# EAGLE design Pioneer_Kit_Shield (EAGLE 7.7.0)

## Sheet 1 of 2
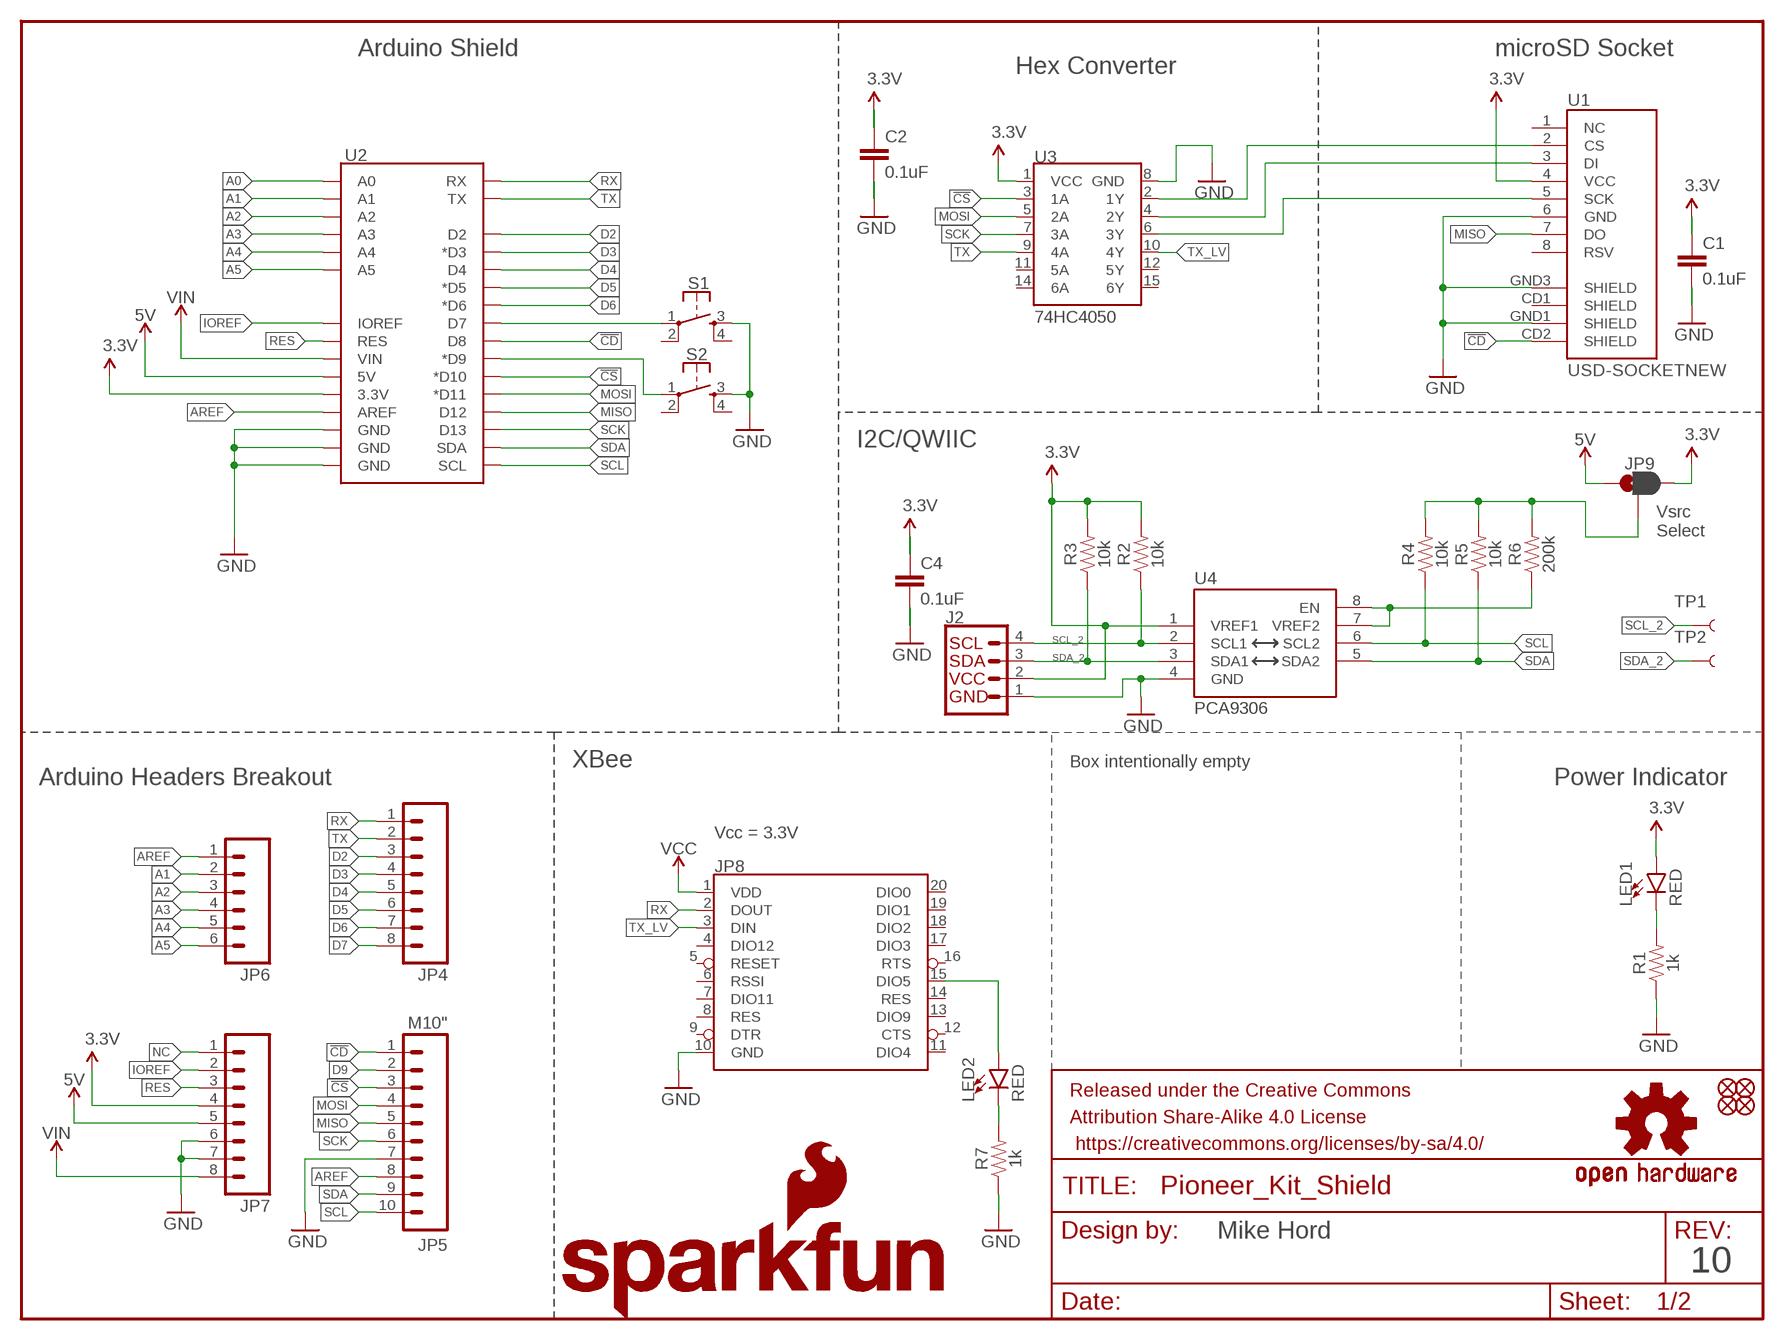
[diagram p0: schematic, sheet 1]

### Parts
C1  0.1uF  0.1UF-0603-25V-5%  [0603]
C2  0.1uF  0.1UF-0603-25V-5%  [0603]
C4  0.1uF  0.1UF-0603-25V-5%  [0603]
FRAME1  FRAME-LETTER  [CREATIVE_COMMONS]
J2  QWIIC_CONNECTORJS-1MM  [1X04_1MM_RA]
JP1  SFE_LOGO_NAME_FLAME.1_INCH  [SFE_LOGO_NAME_FLAME_.1]
JP2  FIDUCIAL1X2  [FIDUCIAL-1X2]
JP3  FIDUCIAL1X2  [FIDUCIAL-1X2]
JP4  M08  [1X08]
JP5  M10"  [1X10]
JP6  M06SIP  [1X06]
JP7  M081X08  [1X08]
JP8  XBEESMD  [XBEE-SMD]
JP9  JUMPER-SMT_3_1-NC_PASTE_SILK  [SMT-JUMPER_3_1-NC_PASTE_SILK]
JP10  FIDUCIAL1X2  [FIDUCIAL-1X2]
JP11  FIDUCIAL1X2  [FIDUCIAL-1X2]
LED1  RED  LED-RED0603  [LED-0603]
LED2  RED  LED-RED0603  [LED-0603]
LOGO1  OSHW-LOGOM  [OSHW-LOGO-M]
R1  1k  1KOHM-0603-1/10W-1%  [0603]
R2  10k  10KOHM-0603-1/10W-1%  [0603]
R3  10k  10KOHM-0603-1/10W-1%  [0603]
R4  10k  10KOHM-0603-1/10W-1%  [0603]
R5  10k  10KOHM-0603-1/10W-1%  [0603]
R6  200k  200KOHM-0603-1/10W-1%  [0603]
R7  1k  1KOHM-0603-1/10W-1%  [0603]
S1  MOMENTARY-SWITCH-SPST-2-SMD-5.2MM  [TACTILE_SWITCH_SMD_5.2MM]
S2  MOMENTARY-SWITCH-SPST-2-SMD-5.2MM  [TACTILE_SWITCH_SMD_5.2MM]
TP1  TEST-POINTTP_15TH_THRU  [TP_15TH]
TP2  TEST-POINTTP_15TH_THRU  [TP_15TH]
U1  USD-SOCKETNEW  [MICRO-SD-SOCKET-PP]
U2  ARDUINO_UNO_R3_SHIELDUNO_R3_SHIELD_NOLABELS_LOCK  [UNO_R3_SHIELD_NOLABELS_LOCK]
U3  74HC4050  HEX_CONVERTER  [SO16]
U4  PCA9306  PCA9306PCA9306DC-1:1  [PCA9306DC]

### Nets
3.3V: C1.1 C2.1 C4.1 J2.2(VCC) JP7.4 JP9.3 LED1.A R2.2 R3.2 U1.4(VCC) U2.3.3V U3.1(VCC) U4.1(VREF1)
5V: JP7.5 JP9.1 U2.5V ; also sheet 2
!CD: JP5.1 U1.CD2(SHIELD) U2.D8
!CS: JP5.3 U2.D10(*D10) U3.3(1A)
A0: JP6.1 U2.A0
A1: JP6.2 U2.A1
A2: JP6.3 U2.A2
A3: JP6.4 U2.A3
A4: JP6.5 U2.A4
A5: JP6.6 U2.A5
AREF: JP5.8 U2.AREF
D2: JP4.3 U2.D2
D3: JP4.4 U2.D3(*D3)
D4: JP4.5 U2.D4
D5: JP4.6 U2.D5(*D5)
D6: JP4.7 U2.D6(*D6)
D7: JP4.8 S1.1 U2.D7
D9: JP5.2 S2.1 U2.D9(*D9)
GND: C1.2 C2.2 C4.2 J2.1(GND) JP5.7 JP7.6 JP7.7 JP8.10(GND) R1.1 R7.1 S1.3 S2.3 U1.6(GND) U1.GND1(SHIELD) U1.GND3(SHIELD) U2.GND@0(GND) U2.GND@1(GND) U2.GND@2(GND) U3.8(GND) U4.4(GND) ; also sheet 2
IOREF: JP7.2 U2.IOREF
MISO: JP5.5 U1.7(DO) U2.D12
MOSI: JP5.4 U2.D11(*D11) U3.5(2A)
N$1: LED2.C R7.2
N$2: U1.3(DI) U3.4(2Y)
N$3: JP8.15(DIO5) LED2.A
N$4: U1.5(SCK) U3.6(3Y)
N$6: LED1.C R1.2
N$9: JP9.2 R4.2 R5.2 R6.2
N$19: R6.1 U4.7(VREF2) U4.8(EN)
N$163: U1.2(CS) U3.2(1Y)
NC: JP7.1
RES: JP7.3 U2.RES
RX: JP4.1 JP8.2(DOUT) U2.RX
SCK: JP5.6 U2.D13 U3.7(3A)
SCL: JP5.10 R4.1 U2.SCL U4.6(SCL2)
SCL_2: J2.4(SCL) R2.1 TP1.P$1 U4.2(SCL1)
SDA: JP5.9 R5.1 U2.SDA U4.5(SDA2)
SDA_2: J2.3(SDA) R3.1 TP2.P$1 U4.3(SDA1)
TX: JP4.2 U2.TX U3.9(4A)
TX_LV: JP8.3(DIN) U3.10(4Y)
VCC: JP8.1(VDD) ; also sheet 2
VIN: JP7.8 U2.VIN
Unconnected: JP8.4(DIO12) JP8.5(RESET) JP8.6(RSSI) JP8.7(DIO11) JP8.8(RES) JP8.9(DTR) JP8.11(DIO4) JP8.12(CTS) JP8.13(DIO9) JP8.14(RES) JP8.16(RTS) JP8.17(DIO3) JP8.18(DIO2) JP8.19(DIO1) JP8.20(DIO0) S1.2 S1.4 S2.2 S2.4 U1.1(NC) U1.8(RSV) U1.CD1(SHIELD) U3.11(5A) U3.12(5Y) U3.14(6A) U3.15(6Y)

### Notes on the sheet
- Arduino Shield | microSD Socket
- Hex Converter
- I2C/QWIIC
- Vsrc
  Select
- XBee | Box intentionally empty | Power Indicator
- Arduino Headers Breakout
- Vcc = 3.3V
- Mike Hord
- 10

## Sheet 2 of 2
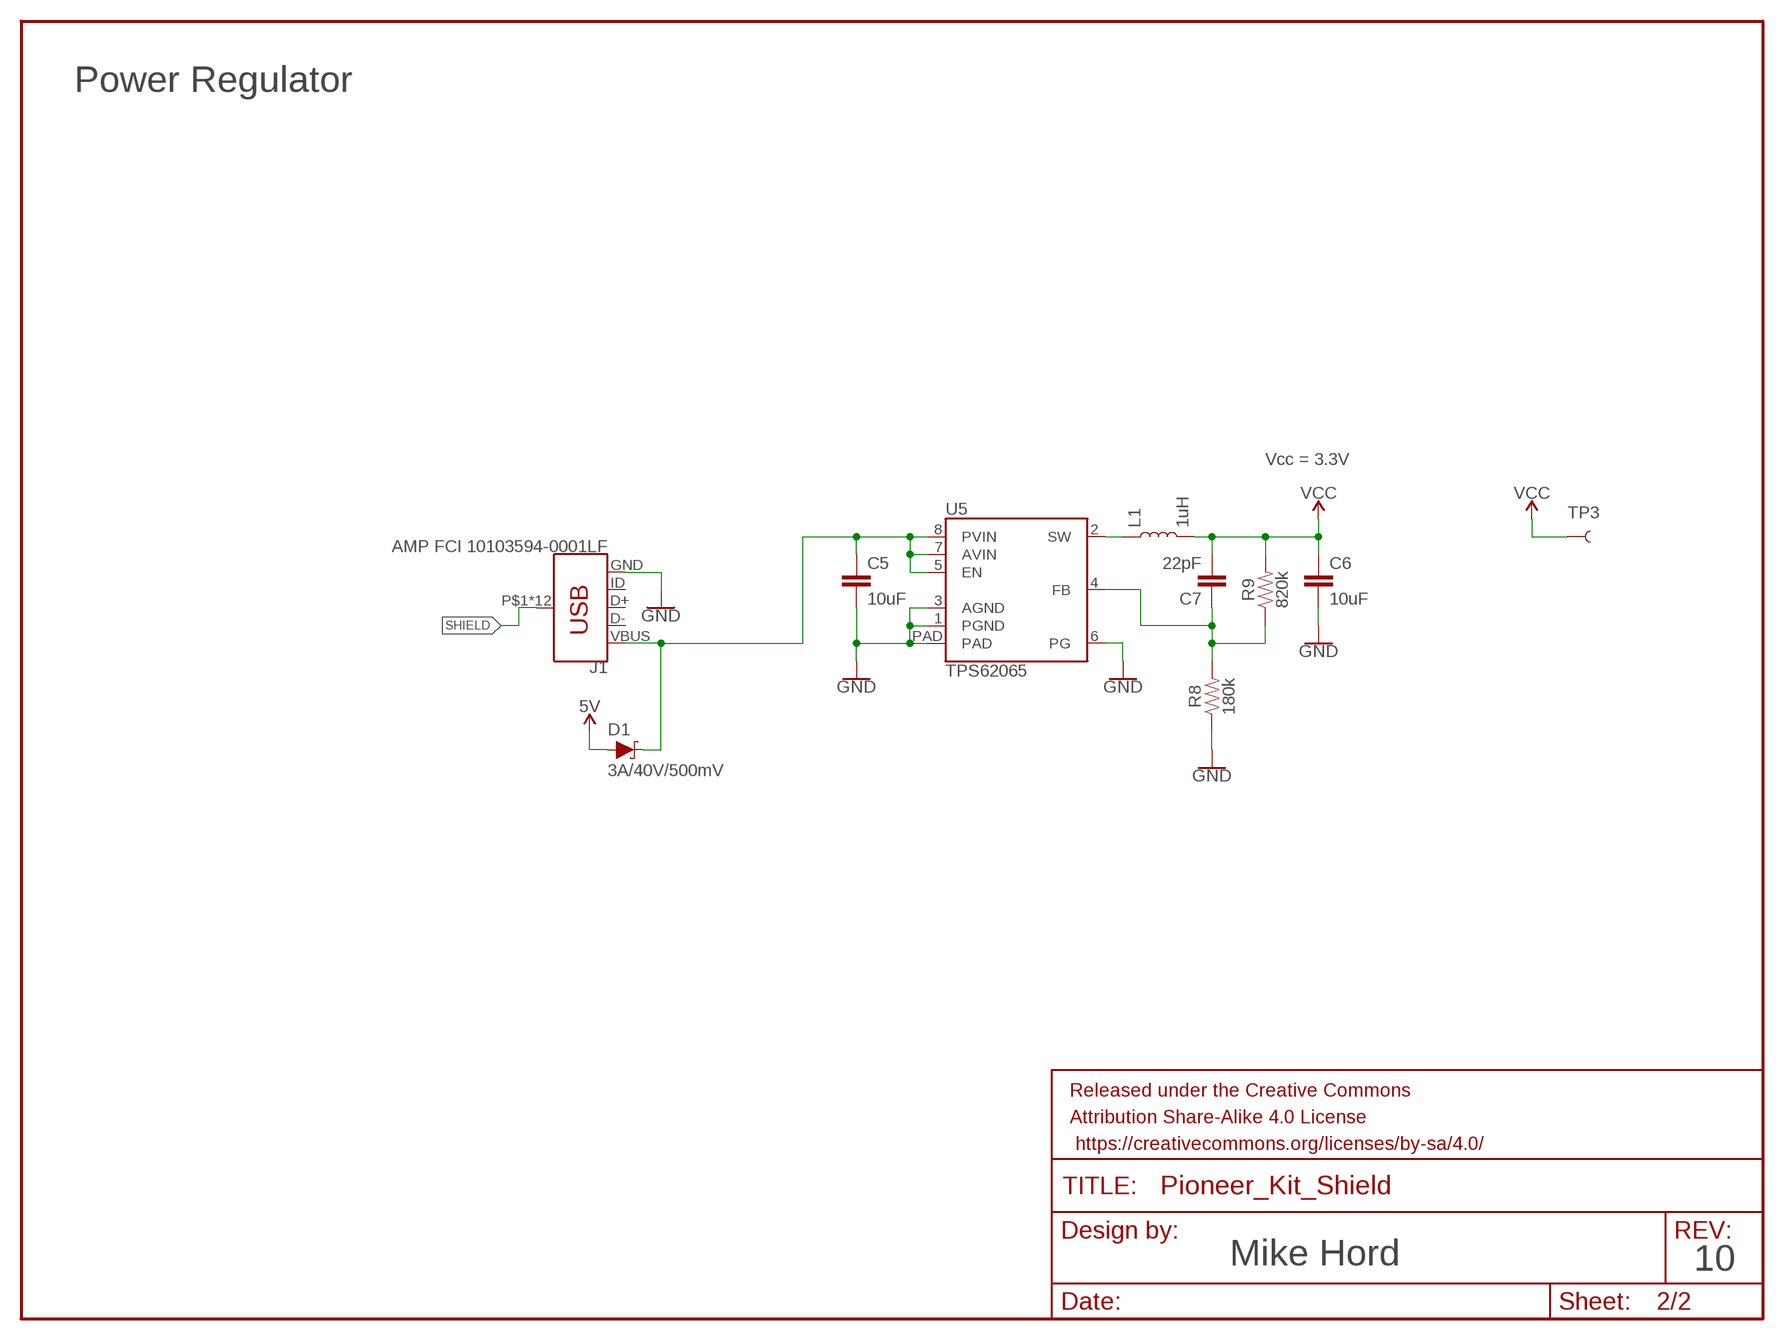
[diagram p1: schematic, sheet 2]

### Parts
C5  10uF  10UF-0805-10V-10%  [0805]
C6  10uF  10UF-0603-6.3V-20%  [0603]
C7  22pF  22PF-0603-50V-5%  [0603]
D1  3A/40V/500mV  DIODE-SCHOTTKY-B340A  [SMA-DIODE]
FRAME2  FRAME-LETTERNO_PACKAGE  [DUMMY]
J1  AMP FCI 10103594-0001LF  USB_MICRO-B_HALF_PTH  [USB-MICROB-PTH]
L1  1uH  INDUCTOR-SRP4020-1UH  [INDUCTOR-SRP4020]
R8  180k  180KOHM-0603-1/10W-1%  [0603]
R9  820k  820KOHM-0603-1/10W-1%  [0603]
TP3  TEST-POINTTP_15TH_THRU  [TP_15TH]
U5  TPS62065  [WSON-8-PAD]

### Nets
5V: D1.A ; also sheet 1
GND: C5.2 C6.2 J1.GND R8.1 U5.1(PGND) U5.3(AGND) U5.6(PG) U5.PAD ; also sheet 1
N$20: C5.1 D1.C J1.VBUS U5.5(EN) U5.7(AVIN) U5.8(PVIN)
N$31: C7.1 R8.2 R9.1 U5.4(FB)
N$32: L1.P$1 U5.2(SW)
SHIELD: J1.P$1(SHIELD) J1.P$2(SHIELD) J1.P$3(SHIELD) J1.P$4(SHIELD) J1.P$6(SHIELD) J1.P$8(SHIELD) J1.P$10(SHIELD) J1.P$12(SHIELD) J1.SHEILD2(SHIELD) J1.SHIELD J1.SHIELD3(SHIELD) J1.SHIELD4(SHIELD)
VCC: C6.1 C7.2 L1.P$2 R9.2 TP3.P$1 ; also sheet 1
Unconnected: J1.D+ J1.D- J1.ID

### Notes on the sheet
- Power Regulator
- Vcc = 3.3V
- Mike Hord | 10

## Library data of the parts
C1 C2 C4 = SparkFun-Capacitors:0.1UF: 0.1µF ceramic capacitors A capacitor is a passive two-terminal electrical component used to store electrical energy temporarily in an electric field.; PROD_ID: CAP-08604
C5 = SparkFun-Capacitors:10UF: 10.0µF ceramic capacitors A capacitor is a passive two-terminal electrical component used to store electrical energy temporarily in an electric field.; PROD_ID: CAP-11330
C6 = SparkFun-Capacitors:10UF: 10.0µF ceramic capacitors A capacitor is a passive two-terminal electrical component used to store electrical energy temporarily in an electric field.; PROD_ID: CAP-11015
C7 = SparkFun-Capacitors:22PF: 22pF ceramic capacitors A capacitor is a passive two-terminal electrical component used to store electrical energy temporarily in an electric field.; PROD_ID: CAP-07876
D1 = SparkFun-DiscreteSemi:DIODE-SCHOTTKY: Schottky diode A Schottky diode is a semiconductor diode which has a low forward voltage drop and a very fast switching action.; PROD_ID: DIO-09886
FRAME1 = SparkFun-Aesthetics:FRAME-LETTER: Schematic Frame - Letter Standard 8.5x11 US Letter frame
FRAME2 = SparkFun-Aesthetics:FRAME-LETTER: Schematic Frame - Letter Standard 8.5x11 US Letter frame; DESIGNER: Nobody; VERSION: v01
J1 = SparkFun-Connectors:USB_MICRO-B: USB Type Micro-B Connector Male/female and PTH/SMT variants SparkFun Products: SparkFun microB USB Breakout <https://www.sparkfun.com/products/12035> SparkFun USB microB Plug Breakout <https://www.sparkfun.com/products/10031> SparkFun ESP8266 Thing <https://www.sparkfun.com/products/13231>; PROD_ID: CONN-13711
J2 = SparkFun-Connectors:QWIIC_CONNECTOR: SparkFun I2C Standard Qwiic Connector An SMD 1mm pitch JST connector makes it easy and quick (get it? Qwiic?) to connect I2C devices to each other. The Qwiic system <http://www.sparkfun.com/qwiic> enables fast and solderless connection between popular platforms and various sensors and actuators. We carry 200mm <https://www.sparkfun.com/products/14204>, 100mm <https://www.sparkfun.com/products/14205>, 50mm <https://www.sparkfun.com/products/14206>, and breadboard friendly <https://www.sparkfun.com/products/14207> Qwiic cables. We also offer 10 pcs strips <https://www.sparkfun.com/products/14323> the SMD connectors.; PROD_ID: CONN-13694
JP1 = SparkFun-Aesthetics:SFE_LOGO_NAME_FLAME: SparkFun Font Logo w/ Flame This is the SparkFun full logo. The logo on the schematic will always be the same size; the package variant is the height of the flame part of the logo. Default layer for the logo on the board is tSilk.
JP2 JP3 JP10 JP11 = SparkFun-Aesthetics:FIDUCIAL: Fiducial Alignment Points Point-of-reference for pick-and-place machines and other optical instruments.
JP4 = SparkFun:M08: Header 8 Standard 8-pin 0.1" header. Use with straight break away headers (SKU : PRT-00116), right angle break away headers (PRT-00553), swiss pins (PRT-00743), machine pins (PRT-00117), and female headers (PRT-00115).
JP5 = SparkFun-Connectors:M10: Header 10 Standard 10-pin 0.1" header. Use with straight break away headers (SKU : PRT-00116), right angle break away headers (PRT-00553), swiss pins (PRT-00743), machine pins (PRT-00117), and female headers (PRT-00115).
JP6 = SparkFun:M06: Header 6 Standard 6-pin 0.1" header. Use with straight break away headers (SKU : PRT-00116), right angle break away headers (PRT-00553), swiss pins (PRT-00743), machine pins (PRT-00117), and female headers (PRT-00115). Molex polarized connector foot print use with SKU : PRT-08094 with associated crimp pins and housings. NOTES ON THE VARIANTS LOCK and LOCK_LONGPADS... This footprint was designed to help hold the alignment of a through-hole component (i.e. 6-pin header) while soldering it into place. You may notice that each hole has been shifted either up or down by 0.005 of an inch from it's more standard position (which is a perfectly straight line). This slight alteration caused the pins (the squares in the middle) to touch the edges of the holes. Because they are alternating, it causes a "brace" to hold the component in place. 0.005 has proven to be the perfect amount of "off-center" position when using our standard breakaway headers. Although looks a little odd when you look at the bare footprint, once you have a header in there, the alteration is very hard to notice. Also, if you push a header all the way into place, it is covered up entirely on the bottom side. This idea of altering the position of holes to aid alignment will be further integrated into the Sparkfun Library for other footprints. It can help hold any component with 3 or more connection pins.
JP7 = SparkFun-Connectors:M08: Header 8 Standard 8-pin 0.1" header. Use with straight break away headers (SKU : PRT-00116), right angle break away headers (PRT-00553), swiss pins (PRT-00743), machine pins (PRT-00117), and female headers (PRT-00115).
JP8 = SparkFun-RF:XBEE: Digi XBee and XBee Pro XBees are tiny blue chips that can communicate wirelessly with each other. They can do simple things, like replacing a couple of wires in serial communication, which is nice when you want to make a remote for your paintball vehicle. SparkFun Products SparkFun XBee Buying Guide <https://www.sparkfun.com/pages/xbee_guide> SparkFun XBee Explorer USB <https://www.sparkfun.com/products/11812> (WRL-11812) Breakout Board for XBee Module <https://www.sparkfun.com/products/8276> (WRL-8276) SparkFun XBee Explorer Regulated <https://www.sparkfun.com/products/11373> (WRL-11373) SparkFun XBee Explorer Dongle <https://www.sparkfun.com/products/11697> (WRL-11697) SparkFun XBee Shield <https://www.sparkfun.com/products/12847> (WRL-12847) SparkFun XBee Explorer Serial <https://www.sparkfun.com/products/13225> (WRL-13225); PROD_ID: CONN-09042
JP9 = SparkFun-Jumpers:JUMPER-SMT_3_1-NC_PASTE: Normally closed solder jumper (1 of 2 connections) This jumper has an aperture in the stencil to allow solder paste to bridge one of the two connections. One connection is normally closed (NC), while the other is normally open (NO). Wick off the solder to open the connection. Reapply solder to reclose the connection. Apply solder to the other side instead to change the current path.
L1 = SparkFun-Coils:INDUCTOR: Inductors Resist changes in electrical current. Basically a coil of wire. SparkFun Products: SparkFun Load Cell Amplifier - HX711 <https://www.sparkfun.com/products/13879> IOIO-OTG - V2.2 <https://www.sparkfun.com/products/13613>; PROD_ID: NDUC-12274
LED1 LED2 = SparkFun-LED:LED-RED: Red SMD LED Used in manufacturing of most products at SparkFun Packages: 0603 - SMD 0603 package [Product Link] <http://docs.avagotech.com/docs/AV02-0551EN> 0603 SMART - SMD 0603 SMART package ( more efficient and expensive)[Product Link] <http://www.osram-os.com/Graphics/XPic2/00077099_0.pdf> 1206 - SMD1206 package [Product Link] <https://www.sparkfun.com/datasheets/DevTools/LilyPad/Q150OVS4.pdff> SparkFun Products: Pro Mini 328 -5V <https://www.sparkfun.com/products/821> RedBoard <https://www.sparkfun.com/products/12757> IOIO-OTG <https://www.sparkfun.com/products/13613>; PROD_ID: DIO-00819
LOGO1 = SparkFun-Aesthetics:OSHW-LOGO: Open-Source Hardware (OSHW) Logo This logo indicates the piece of hardware it is found on incorporates a OSHW license and/or adheres to the definition of open source hardware found here: http://freedomdefined.org/OSHW
R1 R7 = SparkFun-Resistors:1KOHM: 1kΩ resistor A resistor is a passive two-terminal electrical component that implements electrical resistance as a circuit element. Resistors act to reduce current flow, and, at the same time, act to lower voltage levels within circuits. - Wikipedia; PROD_ID: RES-07856
R2-R5 = SparkFun-Resistors:10KOHM: 10kΩ resistor A resistor is a passive two-terminal electrical component that implements electrical resistance as a circuit element. Resistors act to reduce current flow, and, at the same time, act to lower voltage levels within circuits. - Wikipedia; PROD_ID: RES-00824
R6 = SparkFun-Resistors:200KOHM: 200kΩ resistor A resistor is a passive two-terminal electrical component that implements electrical resistance as a circuit element. Resistors act to reduce current flow, and, at the same time, act to lower voltage levels within circuits. - Wikipedia; PROD_ID: RES-09385
R8 = SparkFun-Resistors:180KOHM: RES-10066; PROD_ID: RES-10066
R9 = SparkFun-Resistors:820KOHM: 820kΩ resistor A resistor is a passive two-terminal electrical component that implements electrical resistance as a circuit element. Resistors act to reduce current flow, and, at the same time, act to lower voltage levels within circuits. - Wikipedia; PROD_ID: RES-13247
S1 S2 = SparkFun-Switches:MOMENTARY-SWITCH-SPST-2: Momentary Switch (Pushbutton) - SPST - Two Circuits Normally-open (NO) SPST momentary switches (buttons, pushbuttons). Schematic symbol includes two switch circuits. Variants SMD-4.6MMX2.8MM - 4.60mm x 2.80mm Tactile Momentary Button Switch - Used on SparkFun SAMD21 Mini Breakout <https://www.sparkfun.com/products/13664> SMD-5.2MM - Mini Pushbutton Switch - SMD <https://www.sparkfun.com/products/8720> - Used on Arduino Pro Mini <https://www.sparkfun.com/products/11114>; PROD_ID: SWCH-08247; SF_SKU: COM-08720
TP1-TP3 = SparkFun-Connectors:TEST-POINT: SparkFun Test Points Bare copper test points for troubleshooting or In-Circuit-Testing. These are used by our Production team for verifying production board runs using pogo-pins on test beds. SparkFun Products: SparkFun LSM9DS1 Breakout <https://www.sparkfun.com/products/13284> SparkFun PSOC <https://www.sparkfun.com/products/13714> SparkFun Load Cell Amplifier <https://www.sparkfun.com/products/13879>
U1 = SparkFun:USD-SOCKET: microSD Socket Push-push type uSD socket. Schematic element and footprint production proven. Spark Fun Electronics SKU : PRT-00127. tDoc lines correctly indicate media card edge positions when inserting (unlocked, locked, depressed).; PROD_ID: CONN-7820
U2 = SparkFun-Boards:ARDUINO_UNO_R3_SHIELD: Arduino R3 Shield Footprint Shield form compatible with the Arduino Uno R3. SparkFun Products: MG2639 Cellular Shield <https://www.sparkfun.com/products/13120> MIDI Shield <https://www.sparkfun.com/products/12898> R3 Stackable Headers Kit <https://www.sparkfun.com/products/11417>
U3 = SparkFun-IC-Comms:HEX_CONVERTER: 74HC4050 Hex Buffer 74HC4050 Hex Buffer Level Shifter SMD SO016 SparkFun Products CAN-BUS Shield <https://www.sparkfun.com/products/13262> (DEV-13262) SparkFun MP3 Player Shield <https://www.sparkfun.com/products/12660> (DEV-12660) SparkFun microSD Shield <https://www.sparkfun.com/products/12761> (DEV-12761) SparkFun USB Host Shield <https://www.sparkfun.com/products/9947> (DEV-09947); PROD_ID: IC-09604
U4 = SparkFun-IC-Comms:PCA9306: Bidirectional I2C level shifter Not compatible with all available part number pinout schemes- DOUBLE CHECK!!! Datasheet <https://cdn.sparkfun.com/datasheets/BreakoutBoards/PCA9306DC.pdf> SparkFun Products SparkFun Inventor's Kit for RedBot <https://www.sparkfun.com/products/12649> (ROB-12649) SparkFun RedBot Basic Kit <https://www.sparkfun.com/products/13166> (ROB-13166) SparkFun Level Translator Breakout - PCA9306 <https://www.sparkfun.com/products/11955> (BOB-11955) SparkFun Block for Intel Edison - ADC <https://www.sparkfun.com/products/13770> (DEV-13770) SparkFun Block for Intel® Edison - Raspberry Pi B <https://www.sparkfun.com/products/13044> (DEV-13044) SparkFun RedBot Sensor - Accelerometer <https://www.sparkfun.com/products/12589> (SEN-12589); PROD_ID: IC-10023
U5 = SparkFun-IC-Power:TPS62065: TPS62065 DC/DC step-Down regulator.; PROD_ID: IC-12273

## Board
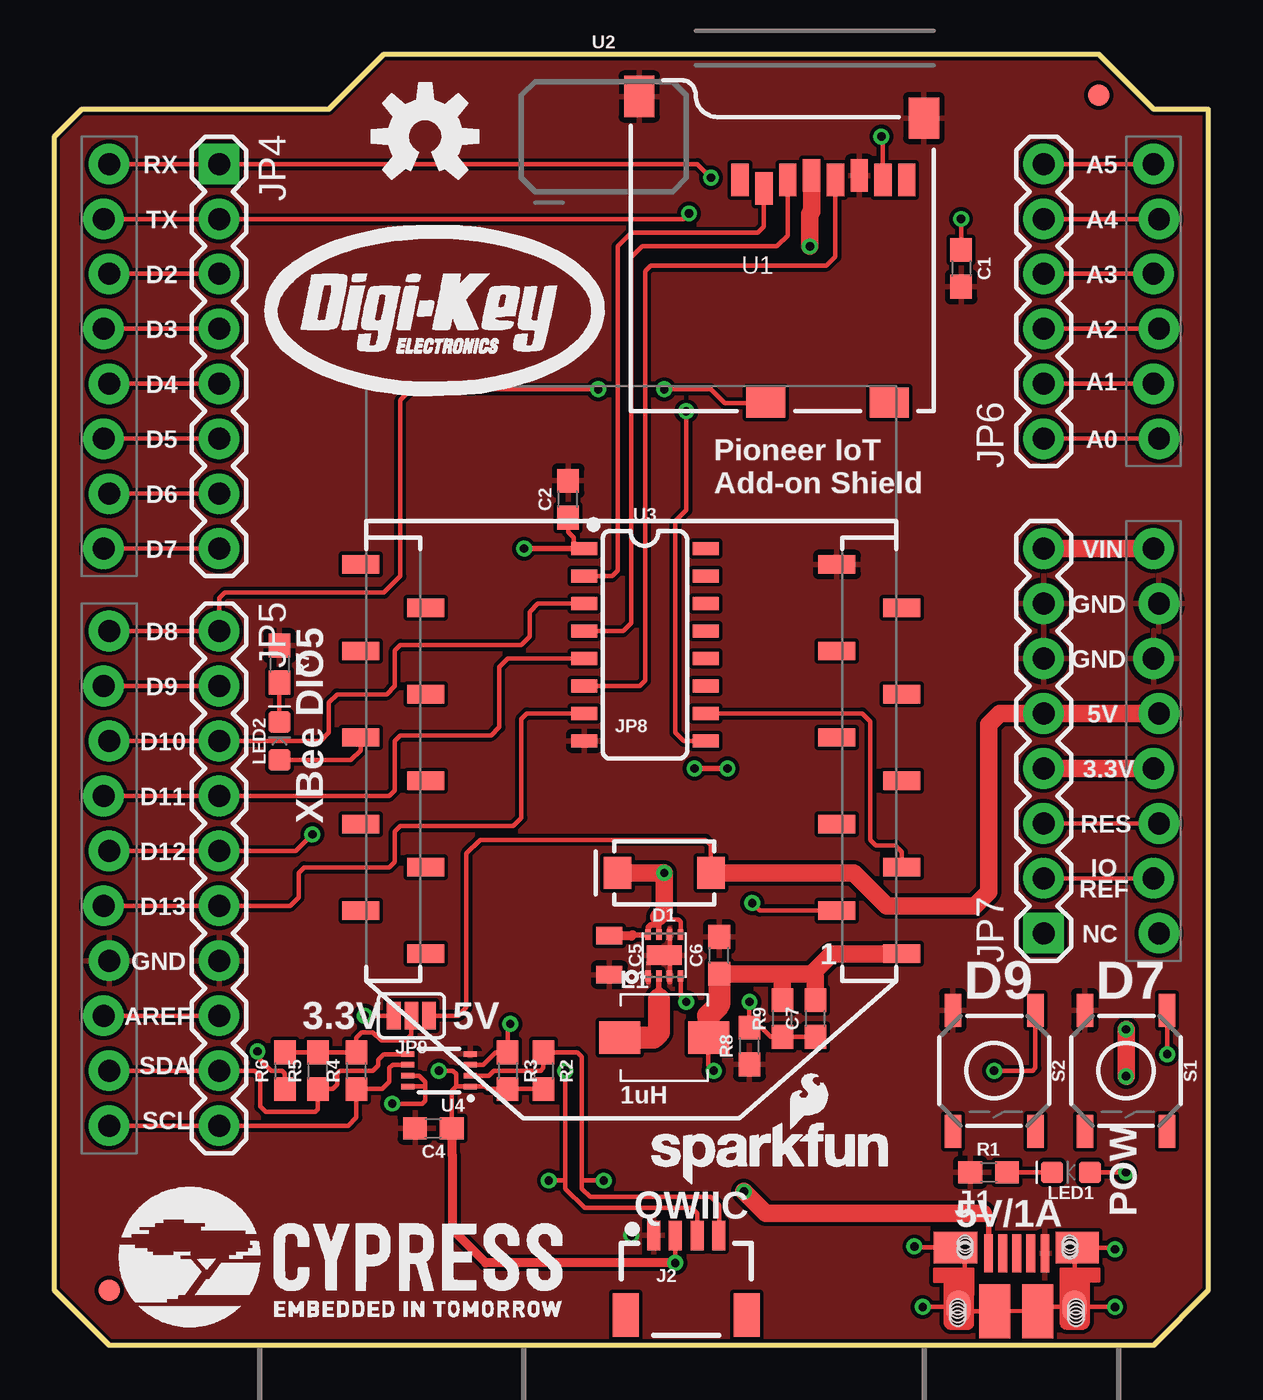
[diagram p2: board, top side]
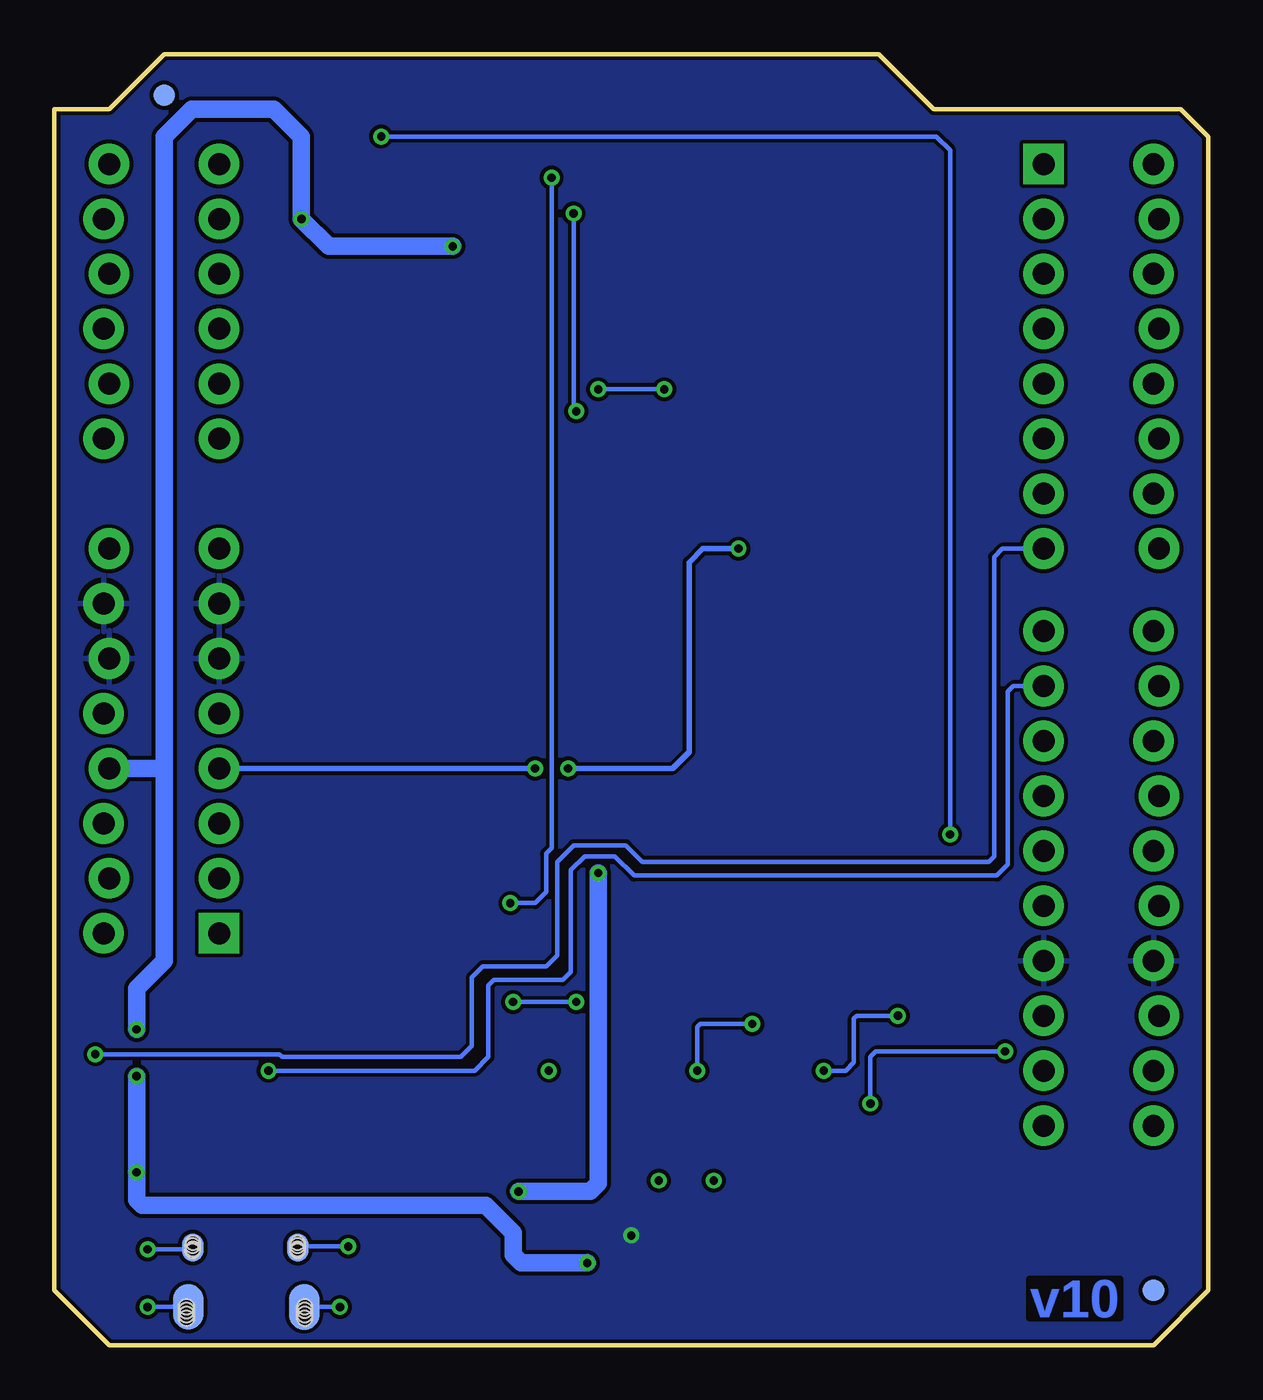
[diagram p3: board, bottom side, seen from below]

Size 53.34 x 59.69 mm. Coordinates in mm from the lower left corner, seen from the top.
Outline: 0,2.54 0,55.88 1.27,57.15 12.7,57.15 15.24,59.69 48.26,59.69 50.8,57.15 53.34,57.15 53.34,2.54 50.8,0 2.54,0 0,2.54
Copper layers (1*16): Top 0.035mm / dielectric 1.5mm / Bottom 0.035mm
Design rules "SparkFun-2-layer-TIGHT": minimum track width 7mil, minimum drill 15mil, track to track 7mil, track to pad 7mil, pad to pad 7mil, via to via 7mil, smd to smd 7mil, copper to edge 7mil, drill to drill 7mil, minimum pad ring 7mil, minimum via ring 7mil, stop-mask expansion 4mil, vias tented up to drill 25mil, thermal gap 10mil
tRestrict: 1 lines

### Footprints (pad centres in the part's own frame; a part is rotated, then mirrored left to right if it is on the bottom)
0603 = smd 1.1 x 1: 1 -0.85,0; 2 0.85,0
0805 = smd 0.8 x 1.2: 1 -0.9,0; 2 0.9,0
SMA-DIODE = smd 1.27 x 1.47: A -2.15,0; C 2.15,0
USB-MICROB-PTH = smd 0.4 x 1.75: D+ 0.031,1.331; D- -0.619,1.331; GND 1.331,1.331; ID 0.681,1.331; VBUS -1.269,1.331 | smd 1.4 x 2.1 bottom: P$1 2.701,-1.142; P$3 -2.659,-1.144 | smd 1 x 1.3: P$2 2.487,1.594; P$6 -2.368,1.604 | smd 1 x 1.3 bottom: P$4 -2.368,1.604; P$10 2.481,1.598 | smd 1.1 x 1.5: P$8 2.701,-1.142; P$12 -2.659,-1.144 | smd 2 x 1.46: SHEILD2 2.831,1.606; SHIELD -2.794,1.606 | smd 1.425 x 2.5: SHIELD3 -0.979,-1.349; SHIELD4 0.996,-1.352 | hole 0.7: -2.693,-1.134; -2.693,-1.3; -2.694,-1.499; -2.694,-1.664; 2.768,-1.134; 2.767,-1.303; 2.766,-1.496; 2.766,-1.664 | hole 0.66: -2.359,1.821; -2.349,1.691; -2.359,1.541; -2.354,1.432; 2.481,1.821; 2.491,1.691; 2.481,1.541; 2.486,1.432
1X04_1MM_RA = smd 0.6 x 1.35: 1 -1.5,0; 2 -0.5,0; 3 0.5,0; 4 1.5,0 | smd 1.2 x 2: NC1 2.8,-3.675; NC2 -2.8,-3.675
FIDUCIAL-1X2 = smd 1 x 1: 1 0,0
1X08 = drill 1.016 pad 1.88 square: 1 0,0 | drill 1.016 pad 1.88: 2 2.54,0; 3 5.08,0; 4 7.62,0; 5 10.16,0; 6 12.7,0; 7 15.24,0; 8 17.78,0
1X10 = drill 1.016 pad 1.88: 1 0,0; 2 2.54,0; 3 5.08,0; 4 7.62,0; 5 10.16,0; 6 12.7,0; 7 15.24,0; 8 17.78,0; 9 20.32,0; 10 22.86,0
1X06 = drill 1.016 pad 1.88: 1 0,0; 2 2.54,0; 3 5.08,0; 4 7.62,0; 5 10.16,0; 6 12.7,0
XBEE-SMD = smd 1.7 x 0.85: 1 -12.5,20; 2 -9.5,18; 3 -12.5,16; 4 -9.5,14; 5 -12.5,12; 6 -9.5,10; 7 -12.5,8; 8 -9.5,6; 9 -12.5,4; 10 -9.5,2; 11 12.5,2; 12 9.5,4; 13 12.5,6; 14 9.5,8; 15 12.5,10; 16 9.5,12; 17 12.5,14; 18 9.5,16; 19 12.5,18; 20 9.5,20
SMT-JUMPER_3_1-NC_PASTE_SILK = smd 0.635 x 1.27: 1 -0.813,0; 2 0,0; 3 0.813,0
INDUCTOR-SRP4020 = smd 1.9 x 1.5: P$1 -2.05,0; P$2 2.05,0
LED-0603 = smd 1 x 1: A -0.877,0; C 0.877,0
TACTILE_SWITCH_SMD_5.2MM = smd 1.524 x 0.762: 1 -2.794,1.905; 2 2.794,1.905; 3 -2.794,-1.905; 4 2.794,-1.905
TP_15TH = drill 0.381 pad 0.61: P$1 0,0
MICRO-SD-SOCKET-PP = smd 0.8 x 1.5: 1 -8.94,10.7; 2 -7.84,10.3; 3 -6.74,10.7; 4 -5.64,10.9; 5 -4.54,10.7; 6 -3.44,10.9; 7 -2.34,10.7; 8 -1.24,10.7 | smd 1.8 x 1.4: CD1 -2.05,0.4; CD2 -7.75,0.4 | smd 1.4 x 1.9: GND1 -13.6,14.55; GND3 -0.45,13.55
UNO_R3_SHIELD_NOLABELS_LOCK = drill 1.016 pad 1.88: 3.3V 24.13,-3.81; 5V 24.384,-1.27; A0 24.384,11.43; A1 24.13,13.97; A2 24.384,16.51; A3 24.13,19.05; A4 24.384,21.59; A5 24.13,24.13; AREF -24.384,-15.24; D2 -24.13,19.05; D3 -24.384,16.51; D4 -24.13,13.97; D5 -24.384,11.43; D6 -24.13,8.89; D7 -24.384,6.35; D8 -24.13,2.54; D9 -24.384,0; D10 -24.13,-2.54; D11 -24.384,-5.08; D12 -24.13,-7.62; D13 -24.384,-10.16; GND@0 24.13,1.27; GND@1 24.384,3.81; GND@2 -24.13,-12.7; IOREF 24.13,-8.89; NC 24.384,-11.43; RES 24.384,-6.35; RX -24.13,24.13; SCL -24.13,-20.32; SDA -24.13,-17.78; TX -24.384,21.59; VIN 24.13,6.35
SO16 = smd 0.6 x 1.2: 1 -4.445,-2.8; 2 -3.175,-2.8; 3 -1.905,-2.8; 4 -0.635,-2.8; 5 0.635,-2.8; 6 1.905,-2.8; 7 3.175,-2.8; 8 4.445,-2.8; 9 4.445,2.8; 10 3.175,2.8; 11 1.905,2.8; 12 0.635,2.8; 13 -0.635,2.8; 14 -1.905,2.8; 15 -3.175,2.8; 16 -4.445,2.8
PCA9306DC = smd 0.25 x 0.602: 1 -0.73,-1.446; 2 -0.23,-1.446; 3 0.27,-1.446; 4 0.77,-1.446; 5 0.77,1.431; 6 0.27,1.431; 7 -0.23,1.431; 8 -0.73,1.431
WSON-8-PAD = smd 0.25 x 0.5: 1 -0.75,-0.95; 2 -0.25,-0.95; 3 0.25,-0.95; 4 0.75,-0.95; 5 0.75,0.95; 6 0.25,0.95; 7 -0.25,0.95; 8 -0.75,0.95 | smd 1.6 x 0.9: PAD 0,0

### Placement (x,y rotation side)
C1  41.91,49.78 270 top
C2  23.75,39.12 90 top
C4  17.53,10.03 180 top
C5  25.65,18.03 270 top
C6  30.73,18.03 90 top
C7  35.18,15.11 90 top
D1  28.19,21.84 180 top
FRAME1  -7.09,-25.4 0 top  (outside the outline)
FRAME2  -26.67,-22.86 0 top  (outside the outline)
J1  44.45,2.92 0 top
J2  29.21,5.08 0 top
JP1  27.18,7.37 0 top
JP2  48.26,57.78 0 top
JP3  2.54,2.54 0 top
JP4  7.62,54.61 270 top
JP5  7.62,33.02 270 top
JP6  45.72,41.91 90 top
JP7  45.72,19.05 90 top
JP8  26.67,38.1 180 top
JP9  16.51,15.24 180 top
JP10  2.54,2.54 0 bottom
JP11  48.26,57.78 0 bottom
L1  28.19,14.22 0 top
LED1  46.99,8 180 top
LED2  10.41,27.94 90 top
LOGO1  17.14,55.88 0 top
R1  43.18,8 0 top
R2  22.61,12.7 270 top
R3  20.95,12.7 270 top
R4  13.97,12.7 90 top
R5  12.19,12.7 90 top
R6  10.67,12.7 90 top
R7  10.41,31.5 270 top
R8  32.13,13.84 90 top
R9  33.66,15.11 90 top
S1  49.53,12.7 270 top
S2  43.43,12.7 270 top
TP1  25.4,7.62 0 top
TP2  22.86,7.62 0 top
TP3  30.48,12.7 0 top
U1  40.64,43.18 0 top
U2  26.67,30.48 0 top
U3  27.3,32.38 270 top
U4  17.78,12.7 90 top
U5  28.19,18.03 0 top

### Tracks (layer width: path | path; a pad name or v marks a point on that pad's centre or on a via)
3.3V  (via drill 0.38)
  Top 0.203: R2.2 R3.2 20.03,11.85 19.91,11.97 U4.1 18.57,11.97 | C4.1 18.38,11.77 18.57,11.97 | J2.2 v28.71,3.82 v28.7,3.81 | LED1.A v49.53,8 | 18.57,11.97 18.57,12.54 18.41,12.7 v17.78,12.7 | v14.35,15.24 JP9.3 | C2.1 23.75,37.59 24,37.34 24,36.84 | C1.1 v41.91,52.07
  Top 0.254: v29.59,26.67 v31.11,26.67 | v21.72,36.83 21.73,36.84 24,36.84 24.49,36.84 U3.1
  Top 0.406: v28.7,3.81 19.94,3.81 18.41,5.33 18.41,8.76 18.38,8.8 C4.1
  Top 0.813: v49.53,12.45 v49.53,14.61 | JP7.4 U2.3.3V | v34.92,50.8 34.92,52.32 35,52.4 U1.4
  Bottom 0.203: v17.78,12.7 16.76,12.7 16.38,13.08 16.38,15.11 16.26,15.24 v14.35,15.24
  Bottom 0.254: JP7.4 v31.11,26.67 | v29.59,26.67 24.77,26.67 24,27.43 24,36.2 23.37,36.83 v21.72,36.83
  Bottom 0.813: v49.53,12.45 v49.53,8 49.53,6.73 49.28,6.48 33.4,6.48 32.13,5.21 32.13,4.19 31.75,3.81 v28.7,3.81 | v49.53,14.61 49.53,16.51 48.26,17.78 48.26,26.67 | 48.26,26.67 U2.3.3V | 48.26,26.67 48.26,55.88 46.99,57.15 43.18,57.15 41.91,55.88 v41.91,52.07 40.64,50.8 v34.92,50.8
5V
  Top 0.203: D1.A 30.34,23.12 30.1,23.37 19.68,23.37 19.05,22.73 19.05,15.62 18.67,15.24 JP9.1
  Top 0.813: D1.A 36.96,21.84 38.48,20.32 42.55,20.32 43.18,20.95 43.18,28.7 43.69,29.21 JP7.5 U2.5V
!CD  (via drill 0.38)
  Top 0.203: U2.D8 JP5.1 7.62,34.54 7.87,34.8 15.24,34.8 16,35.56 16,43.69 16.51,44.2 v25.15,44.2 | v28.19,44.2 30.35,44.2 30.99,43.56 32.87,43.56 U1.CD2
  Bottom 0.203: v25.15,44.2 v28.19,44.2
!CS
  Top 0.203: U3.3 22.35,34.29 21.97,33.91 21.97,32.77 21.59,32.38 16,32.38 15.75,32.13 15.75,30.48 15.37,30.1 13.08,30.1 12.7,29.72 12.7,28.32 12.32,27.94 JP5.3 U2.D10
A0
  Top 0.203: JP6.1 U2.A0
A1
  Top 0.203: JP6.2 U2.A1
A2
  Top 0.203: JP6.3 U2.A2
A3
  Top 0.203: JP6.4 U2.A3
A4
  Top 0.203: JP6.5 U2.A4
A5
  Top 0.203: JP6.6 U2.A5
AREF
  Top 0.203: U2.AREF JP5.8
D2
  Top 0.203: U2.D2 JP4.3
D3
  Top 0.203: U2.D3 JP4.4
D4
  Top 0.203: U2.D4 JP4.5
D5
  Top 0.203: U2.D5 JP4.6
D6
  Top 0.203: U2.D6 JP4.7
D7  (via drill 0.38)
  Top 0.203: U2.D7 JP4.8 | v51.44,13.46 S1.1
  Bottom 0.203: JP4.8 9.53,36.83 9.91,36.45 9.91,22.61 10.16,22.35 26.16,22.35 26.92,23.11 29.34,23.11 30.1,22.35 30.1,18.03 30.61,17.53 33.53,17.53 34.04,17.02 34.04,13.84 34.54,13.34 42.8,13.34 42.93,13.46 v51.44,13.46
D9  (via drill 0.38)
  Top 0.203: U2.D9 JP5.2 | v43.43,12.7 45.21,12.7 45.34,12.83 S2.1
  Bottom 0.203: JP5.2 9.02,30.48 9.27,30.23 9.27,22.23 9.78,21.72 26.54,21.72 27.43,22.61 28.83,22.61 29.46,21.97 29.46,17.27 29.84,16.89 33.02,16.89 33.27,16.64 33.27,13.34 33.91,12.7 v43.43,12.7
GND  (via drill 0.38)
  Top 0.203: U5.6 28.44,18.28 U5.PAD 28.44,17.78 U5.3
  Top 0.254: 27.44,16.96 27.44,16.79 | 28.44,17.05 28.44,16.79 | 28.45,19.23 28.45,19.05 28.44,19.05 U5.6
  other vias: 26.67,5.08
  pour Bottom: 2.54,0 0,2.54 0,55.88 1.27,57.15 12.7,57.15 15.24,59.69 48.26,59.69 50.8,57.15 53.34,57.15 53.34,2.54 50.8,0
  pour Top: 2.54,0 0,2.54 0,55.88 1.27,57.15 12.7,57.15 15.24,59.69 48.26,59.69 50.8,57.15 53.34,57.15 53.34,2.54 50.8,0
IOREF
  Top 0.203: JP7.2 U2.IOREF
MISO  (via drill 0.38)
  Top 0.203: v11.94,23.62 11.18,22.86 JP5.5 U2.D12 | U1.7 38.3,55.81 v38.23,55.88
  Bottom 0.203: v11.94,23.62 11.94,55.24 12.57,55.88 v38.23,55.88
MOSI
  Top 0.203: U3.5 20.95,31.75 20.57,31.37 20.57,28.57 20.19,28.19 16,28.19 15.75,27.94 15.75,25.65 15.49,25.4 JP5.4 U2.D11
N$1
  Top 0.203: LED2.C R7.2
N$2
  Top 0.203: U3.4 26.29,33.02 26.67,33.4 26.67,50.29 27.18,50.8 33.4,50.8 33.91,51.31 U1.3
N$3
  Top 0.203: JP8.15 14.17,27.5 13.72,27.05 10.43,27.05 LED2.A
N$4
  Top 0.203: U3.6 27.05,30.48 27.3,30.73 27.3,49.66 27.56,49.91 35.69,49.91 36.1,50.32 U1.5
N$6
  Top 0.203: R1.2 LED1.C
N$9
  Top 0.203: JP9.2 16.51,14.35 16.26,14.1 15.11,14.1 14.73,14.48 14.22,14.48 13.97,14.22 R4.2 R5.2 R6.2
N$19  (via drill 0.38)
  Top 0.203: R6.1 10.67,12.57 10.54,12.7 10.03,12.7 9.4,13.34 v9.4,13.59 | v15.62,11.18 17.02,11.18 17.14,11.3 17.14,11.94 | 17.14,11.94 17.14,12.19 16.87,12.47 U4.7 | U4.8 17.11,11.97 17.14,11.94
  Bottom 0.203: v9.4,13.59 15.37,13.59 15.62,13.34 v15.62,11.18
N$20  (via drill 0.38)
  Top 0.203: U5.5 28.94,19.57 28.83,19.68 28.19,19.68 28.07,19.81 27.94,19.81
  Top 0.254: U5.7 27.94,19.56 | 27.94,19.56 27.94,20.32 28.19,20.57 | J1.VBUS 43.18,5.84 | 27.94,19.56 27.82,19.43 27.56,19.43 27.44,19.32 U5.8 26.73,18.98
  Top 0.406: 26.73,18.98 26.67,18.92 25.66,18.92 C5.1 | 43.18,5.84 42.93,6.1
  Top 0.813: D1.C v28.19,21.84 28.19,20.57 28.19,20.07 27.94,19.81 | 42.93,6.1 32.89,6.1 v31.88,7.11
  Bottom 0.813: v28.19,21.84 28.19,7.49 28.57,7.11 v31.88,7.11
N$31  (via drill 0.38)
  Top 0.203: U5.4 28.94,16.14 v29.21,15.88 | C7.1 R9.1 33.11,14.26 32.68,14.69 R8.2 v32.13,15.88
  Bottom 0.203: v32.13,15.88 v29.21,15.88
N$32
  Top 0.254: U5.2 27.94,16.39 27.94,16.38
  Top 0.406: 27.94,16.38 27.94,16
  Top 1.016: 27.94,16 27.94,14.48 27.69,14.22 L1.P$1
N$163
  Top 0.203: U3.2 25.78,35.56 26.04,35.81 26.04,50.8 26.67,51.44 32.51,51.44 32.8,51.72 U1.2
RES
  Top 0.203: JP7.3 U2.RES
RX  (via drill 0.38)
  Top 0.203: U2.RX JP4.1 29.72,54.61 v30.35,53.98 | 32.35,20.35 v32.26,20.45 32.6,20.1 JP8.2
  Bottom 0.203: v30.35,53.98 30.35,22.99 30.61,22.73 30.61,20.95 31.11,20.45 v32.26,20.45
SCK
  Top 0.203: U2.D13 JP5.6 10.92,20.32 11.3,20.7 11.3,21.84 11.56,22.1 15.49,22.1 15.75,22.35 15.75,23.75 16,24 21.21,24 21.59,24.38 21.59,28.96 21.84,29.21 U3.7
SCL
  Top 0.203: U4.6 15.64,12.97 15.49,12.83 15.49,12.19 15.15,11.85 R4.1 13.97,10.54 13.59,10.16 JP5.10 U2.SCL
SCL_2
  Top 0.203: 24.38,7.62 24.38,13.34 24.17,13.55 R2.1 22.61,12.83 22.48,12.7 20.32,12.7 20.09,12.47 U4.2 | 24.38,7.62 24.38,7.24 24.77,6.86 30.35,6.86 30.73,6.48 30.73,5.1 J2.4 | TP1.P$1 24.38,7.62
SDA
  Top 0.203: U4.5 15.24,13.46 14.99,13.21 14.99,12.95 14.73,12.7 13.21,12.7 13.08,12.57 13.08,12.06 12.87,11.85 R5.1 12.19,10.92 12.06,10.79 9.78,10.79 9.53,11.05 9.53,12.45 9.27,12.7 JP5.9 U2.SDA
SDA_2  (via drill 0.38)
  Top 0.203: U4.3 19.83,12.97 20.41,13.55 R3.1 20.95,14.73 v21.08,14.86 | v23.62,12.7 23.62,7.62 | 23.62,7.62 23.62,7.24 24.51,6.35 29.46,6.35 29.72,6.1 J2.3 | TP2.P$1 23.62,7.62
  Bottom 0.203: v21.08,14.86 23.5,14.86 23.62,14.73 v23.62,12.7
SHIELD  (via drill 0.38)
  Top 0.178: J1.SHIELD4 45.36,1.6 43.59,1.6 J1.SHIELD3
  Top 0.203: J1.SHIELD J1.P$6 | J1.P$2 J1.P$10 | J1.P$10 J1.P$2 | J1.SHIELD3 42,1.57 J1.P$12 | J1.P$6 42.08,2.07 J1.P$12 | J1.P$8 47.15,4.3 J1.P$2 | J1.P$8 45.66,1.78 J1.SHIELD4 | J1.P$12 v40.13,1.78 | J1.SHEILD2 46.95,4.53 J1.P$2 | J1.P$10 48.95,4.52 v49.02,4.45 | v49.02,1.78 J1.P$8 | J1.P$6 39.8,4.53 v39.75,4.57
  Bottom 0.203: v40.13,1.78 J1.P$12 | J1.P$2 J1.P$10 J1.SHEILD2 47.36,4.45 v49.02,4.45 | J1.P$8 v49.02,1.78 | v39.75,4.57 41.61,4.57 J1.SHIELD J1.P$6
TX  (via drill 0.38)
  Top 0.203: U2.TX JP4.2 29.08,52.07 v29.34,52.32 | v29.21,43.18 29.21,38.61 28.7,38.1 28.7,28.32 29.08,27.94 U3.9
  Bottom 0.203: v29.34,52.32 29.34,43.31 v29.21,43.18
TX_LV
  Top 0.203: U3.10 37.34,29.21 37.72,28.83 37.72,23.37 37.97,23.11 38.86,23.11 39.17,22.81 JP8.3
VCC
  Top 0.203: 30.23,14.24 30.23,12.95 TP3.P$1
  Top 0.813: C6.1 33.78,17.18 | 33.78,17.18 35.01,17.18 | 35.01,17.18 35.18,17.02 C7.2 | R9.2 33.66,17.06 33.78,17.18 | JP8.1 35.93,18.1 35.01,17.18
  Top 1.016: C6.1 30.73,15.75 30.23,15.24 30.23,14.24 L1.P$2
VIN
  Top 0.813: JP7.8 U2.VIN

### Text on the board
Bottom: v10
tPlace: RX | A5 | TX | A4 | D2 | A3 | D3 | A2 | D4 | A1 | D5 | A0 | D6 | Pioneer IoT / Add-on Shield | D7 | VIN | GND | D8 | GND | D9 | 5V | D10 | 3.3V | D11 | RES | XBee DIO5 | D12 | IO / REF | D13 | NC | GND | AREF | 3.3V | 5V | D9 | D7 | SDA | SCL | QWIIC | POW | 5V/1A
Measures: Dimensions in INCHES
tDocu: Mike Hord